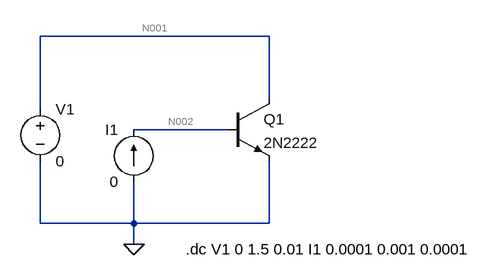
[diagram p0: schematic Lab_4_BJT_Curve_Trace_ (1).asc]
Lab_4_BJT_Curve_Trace_ (1).asc, the LTspice schematic file:
Version 4
SHEET 1 880 680
WIRE 224 16 -128 16
WIRE 224 112 224 16
WIRE -128 128 -128 16
WIRE 160 160 16 160
WIRE -128 304 -128 208
WIRE 16 304 16 240
WIRE 16 304 -128 304
WIRE 224 304 224 208
WIRE 224 304 16 304
WIRE 16 336 16 304
FLAG 16 336 0
SYMBOL npn 160 112 R0
SYMATTR InstName Q1
SYMATTR Value 2N2222
SYMBOL current 16 240 R180
WINDOW 0 24 80 Left 2
WINDOW 3 24 0 Left 2
WINDOW 123 0 0 Left 0
WINDOW 39 0 0 Left 0
SYMATTR InstName I1
SYMATTR Value 0
SYMBOL voltage -128 112 R0
WINDOW 123 0 0 Left 0
WINDOW 39 0 0 Left 0
SYMATTR InstName V1
SYMATTR Value 0
TEXT 96 344 Left 2 !.dc V1 0 1.5 0.01 I1 0.0001 0.001 0.0001

The netlist it stands for:
* Lab_4_BJT_Curve_Trace_ (1).asc
Q1 N001 N002 0 0 2N2222
I1 0 N002 0
V1 N001 0 0
.model NPN NPN
.model PNP PNP
.lib standard.bjt
.dc V1 0 1.5 0.01 I1 0.0001 0.001 0.0001
.backanno
.end

* Results of the author's LTspice run, read from the files saved beside the schematic
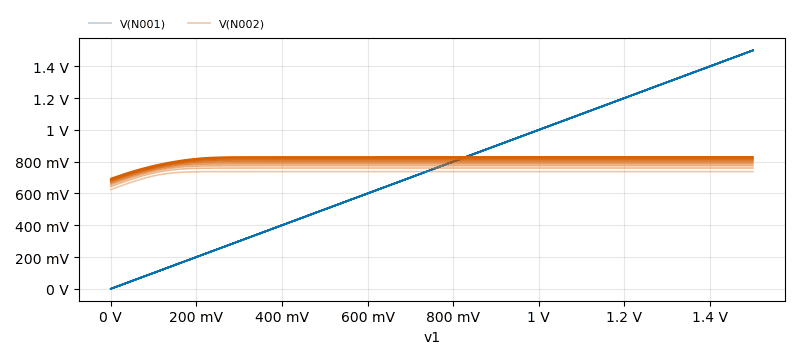
[diagram p1: DC transfer characteristic of Lab_4_BJT_Curve_Trace_ (1).asc, plotted from the saved traces]
* DC transfer characteristic, 10 runs:
*   V(N001) [run 1]: 0 V at v1=0 V, 1.5 V at v1=1.5 V, min 0 V, max 1.5 V
*   V(N001) [run 2]: 0 V at v1=0 V, 1.5 V at v1=1.5 V, min 0 V, max 1.5 V
*   V(N001) [run 3]: 0 V at v1=0 V, 1.5 V at v1=1.5 V, min 0 V, max 1.5 V
*   V(N001) [run 4]: 0 V at v1=0 V, 1.5 V at v1=1.5 V, min 0 V, max 1.5 V
*   V(N001) [run 5]: 0 V at v1=0 V, 1.5 V at v1=1.5 V, min 0 V, max 1.5 V
*   V(N001) [run 6]: 0 V at v1=0 V, 1.5 V at v1=1.5 V, min 0 V, max 1.5 V
*   V(N001) [run 7]: 0 V at v1=0 V, 1.5 V at v1=1.5 V, min 0 V, max 1.5 V
*   V(N001) [run 8]: 0 V at v1=0 V, 1.5 V at v1=1.5 V, min 0 V, max 1.5 V
*   V(N002) [run 1]: 624.6 mV at v1=0 V, 737.4 mV at v1=1.5 V, min 624.6 mV, max 737.4 mV
*   V(N002) [run 2]: 643.6 mV at v1=0 V, 759.8 mV at v1=1.5 V, min 643.6 mV, max 759.8 mV
*   V(N002) [run 3]: 655.1 mV at v1=0 V, 774.4 mV at v1=1.5 V, min 655.1 mV, max 774.4 mV
*   V(N002) [run 4]: 663.6 mV at v1=0 V, 785.8 mV at v1=1.5 V, min 663.6 mV, max 785.8 mV
*   V(N002) [run 5]: 670.4 mV at v1=0 V, 795.3 mV at v1=1.5 V, min 670.4 mV, max 795.3 mV
*   V(N002) [run 6]: 676.1 mV at v1=0 V, 803.6 mV at v1=1.5 V, min 676.1 mV, max 803.6 mV
*   V(N002) [run 7]: 681.1 mV at v1=0 V, 811 mV at v1=1.5 V, min 681.1 mV, max 811 mV
*   V(N002) [run 8]: 685.6 mV at v1=0 V, 817.8 mV at v1=1.5 V, min 685.6 mV, max 817.8 mV